# EAGLE schematic GECBalloonMCUFlightBoard_REV2.0_5-6-19 (EAGLE 7.6.0)
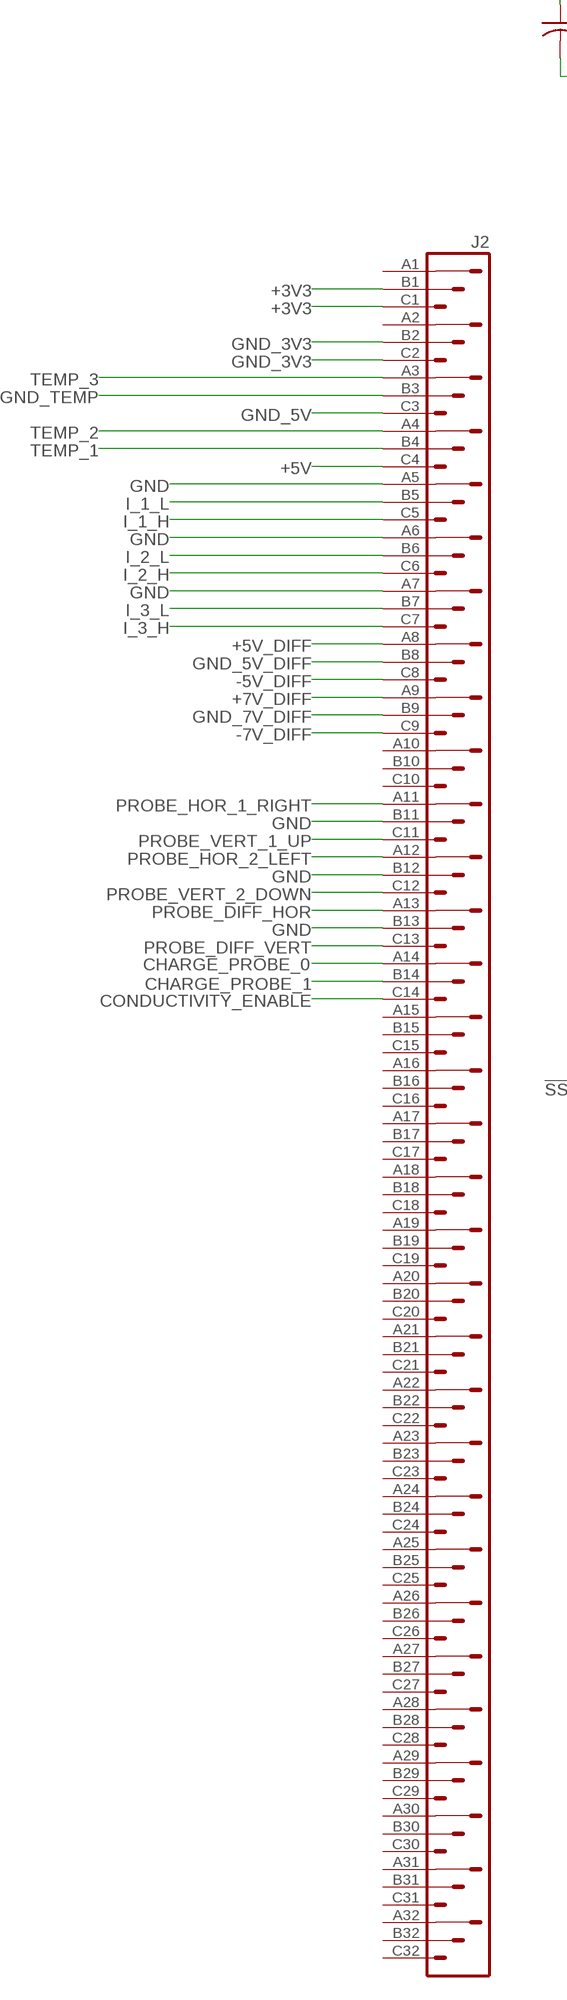
[diagram p0: schematic, sheet 1, part 1 of 2]
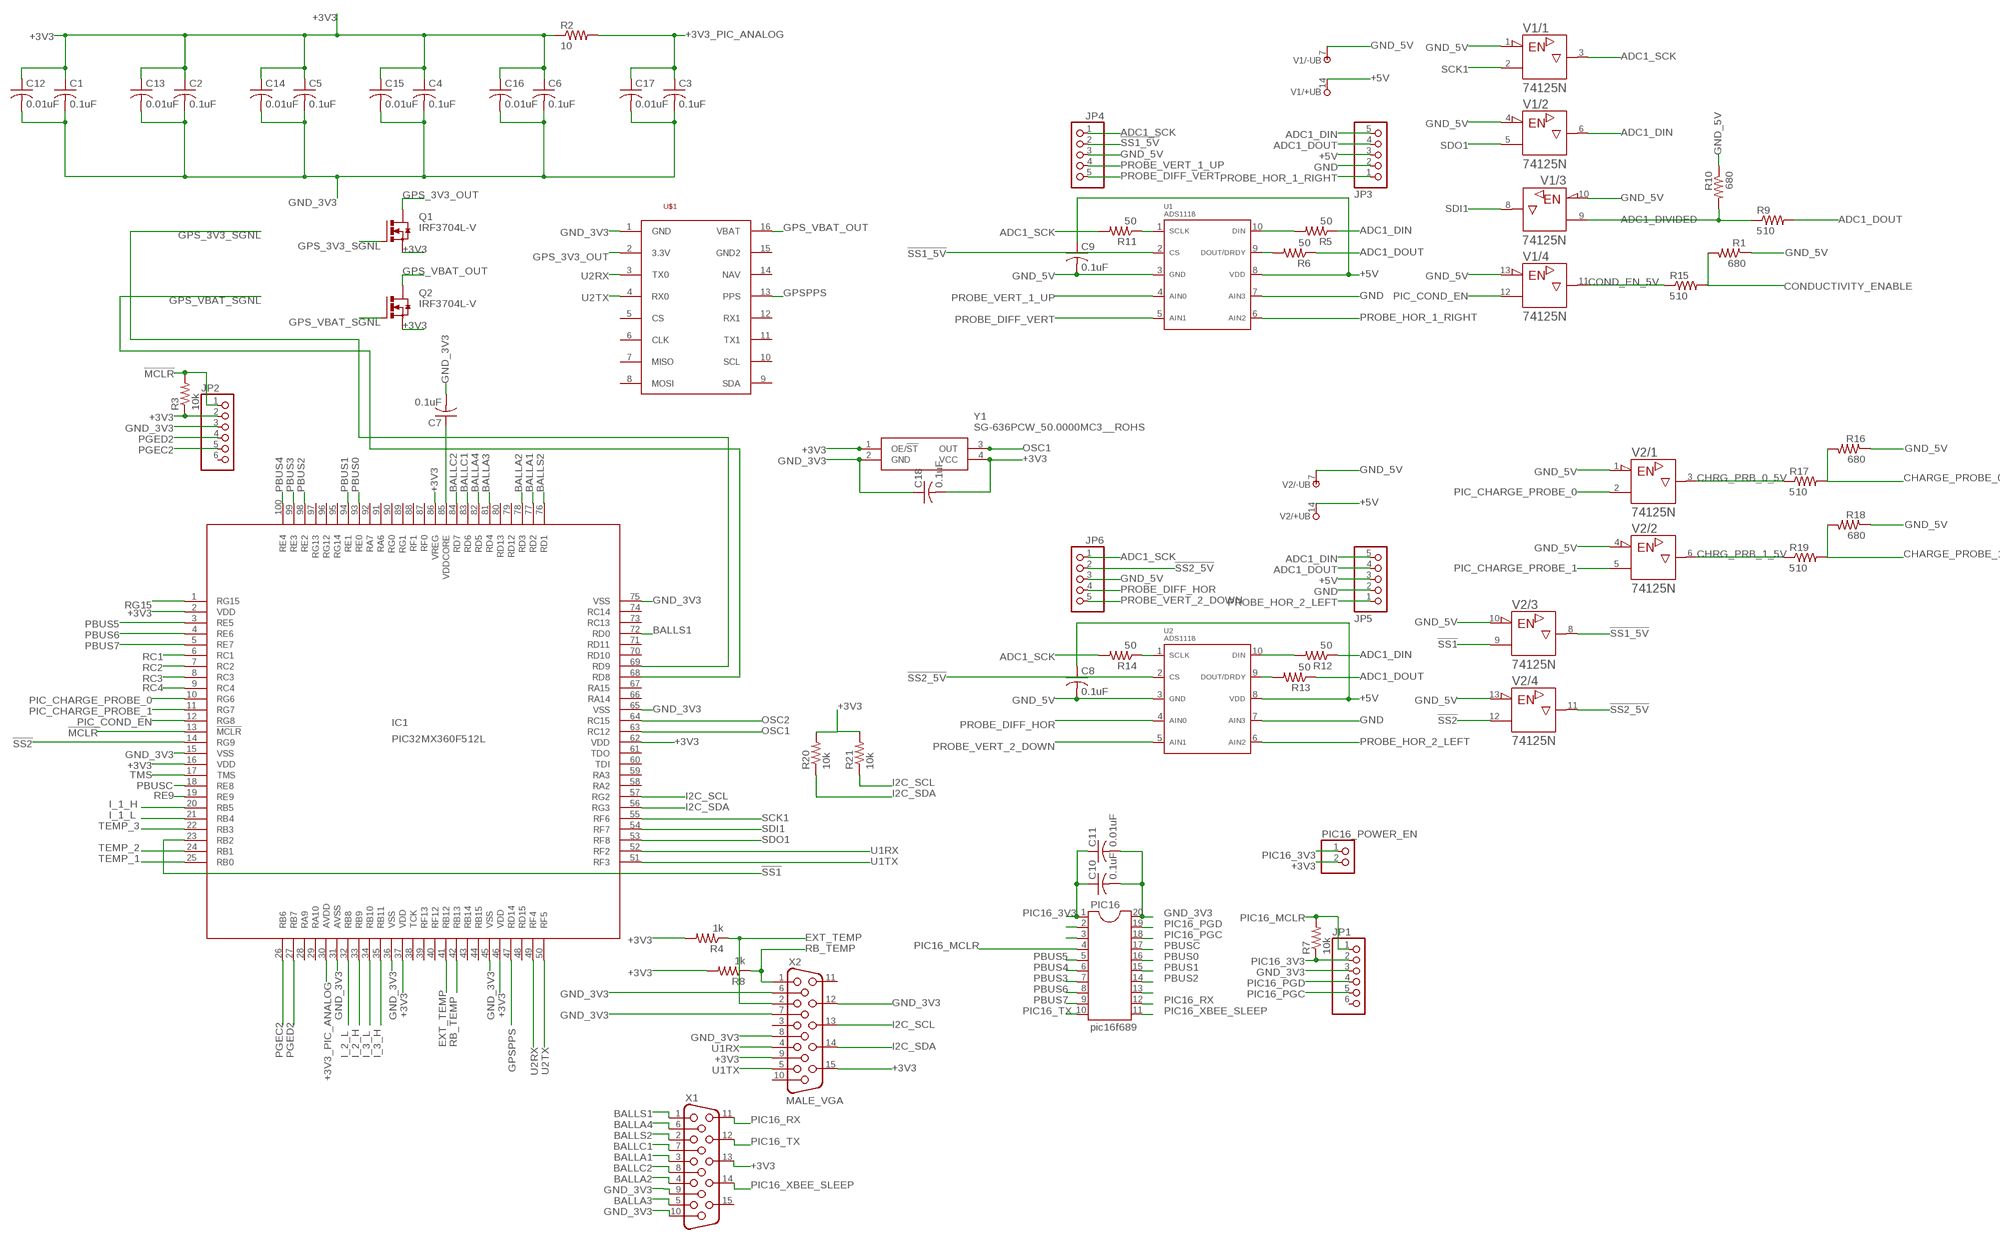
[diagram p1: schematic, sheet 1, part 2 of 2]

## Parts
C1  0.1uF  C-USC1206  [C1206]
C2  0.1uF  C-USC1206  [C1206]
C3  0.1uF  C-USC1206  [C1206]
C4  0.1uF  C-USC1206  [C1206]
C5  0.1uF  C-USC1206  [C1206]
C6  0.1uF  C-USC1206  [C1206]
C7  0.1uF  C-USC1206  [C1206]
C8  0.1uF  C-USC1206  [C1206]
C9  0.1uF  C-USC1206  [C1206]
C10  0.1uF  C-USC1206  [C1206]
C11  0.01uF  C-USC1206  [C1206]
C12  0.01uF  C-USC1206  [C1206]
C13  0.01uF  C-USC1206  [C1206]
C14  0.01uF  C-USC1206  [C1206]
C15  0.01uF  C-USC1206  [C1206]
C16  0.01uF  C-USC1206  [C1206]
C17  0.01uF  C-USC1206  [C1206]
C18  0.1uF  C-USC1206  [C1206]
IC1  PIC32MX360F512L  [TQFP100]
J2  VG96KB  [VG96KB]
JP1  PINHD-1X6  [1X06]
JP2  PINHD-1X6  [1X06]
JP3  PINHD-1X5  [1X05]
JP4  PINHD-1X5  [1X05]
JP5  PINHD-1X5  [1X05]
JP6  PINHD-1X5  [1X05]
PIC16  pic16f689  DIL20  [DIL20]
PIC16_POWER_EN  PINHD-1X2  [1X02]
Q1  IRF3704L-V  [TO262-V]
Q2  IRF3704L-V  [TO262-V]
R1  680  R-US_R1206  [R1206]
R2  10  R-US_M1206  [M1206]
R3  10k  R-US_M1206  [M1206]
R4  1k  R-US_0414/15  [0414/15]
R5  50  R-US_M1206  [M1206]
R6  50  R-US_M1206  [M1206]
R7  10k  R-US_M1206  [M1206]
R8  1k  R-US_0414/15  [0414/15]
R9  510  R-US_R1206  [R1206]
R10  680  R-US_R1206  [R1206]
R11  50  R-US_M1206  [M1206]
R12  50  R-US_M1206  [M1206]
R13  50  R-US_M1206  [M1206]
R14  50  R-US_M1206  [M1206]
R15  510  R-US_R1206  [R1206]
R16  680  R-US_R1206  [R1206]
R17  510  R-US_R1206  [R1206]
R18  680  R-US_R1206  [R1206]
R19  510  R-US_R1206  [R1206]
R20  10k  R-US_M1206  [M1206]
R21  10k  R-US_M1206  [M1206]
U1  ADS1118  ADS1118_MSOP10  [MSOP10]
U2  ADS1118  ADS1118_MSOP10  [MSOP10]
U$1  SPARKFUN_VENUS_GPS_BREAKOUT  [SPARKFUN_BOARD]
V1  74125N  [DIL14]
V2  74125N  [DIL14]
X1  HF15H  [HDF15H]
X2  MALE_VGA  [MALE_PACKAGE]
Y1  SG-636PCW_50.0000MC3__ROHS  [SG-636]

## Nets
!MCLR: IC1.13(!MCLR) JP2.1 R3.2
!SS1: IC1.23(RB2) V2.9(/3:A)
!SS1_5V: JP4.2 U1.2(CS) V2.8(/3:Y)
!SS2: IC1.14(RG9) V2.12(/4:A)
!SS2_5V: JP6.2 U2.2(CS) V2.11(/4:Y)
+3V3 [power]: C1.1 C2.1 C4.1 C5.1 C6.1 C12.1 C13.1 C14.1 C15.1 C16.1 C18.2 IC1.2(VDD) IC1.16(VDD) IC1.37(VDD) IC1.46(VDD) IC1.62(VDD) IC1.86(VREG) J2.B1 J2.C1 JP2.2 PIC16_POWER_EN.2 Q1.3(S) Q2.3(S) R2.1 R3.1 R4.2 R8.2 R20.2 R21.2 X1.13 X2.9 X2.15 Y1.1(OE/!ST) Y1.4(VCC)
+3V3_PIC_ANALOG: C3.1 C17.1 IC1.30(AVDD) R2.2
+5V [power]: C8.1 C9.1 J2.C4 JP3.3 JP5.3 U1.8(VDD) U2.8(VDD) V1.14(/+UB:+UB) V2.14(/+UB:+UB)
+5V_DIFF: J2.A8
+7V_DIFF: J2.A9
-5V_DIFF: J2.C8
-7V_DIFF: J2.C9
ADC1_DIN: JP3.5 JP5.5 R5.1 R12.1 V1.6(/2:Y)
ADC1_DIVIDED: R9.1 R10.2 V1.9(/3:A)
ADC1_DOUT: JP3.4 JP5.4 R6.1 R9.2 R13.1
ADC1_SCK: JP4.1 JP6.1 R11.2 R14.2 V1.3(/1:Y)
BALLA1: IC1.77(RD2) X1.3
BALLA2: IC1.78(RD3) X1.4
BALLA3: IC1.81(RD4) X1.5
BALLA4: IC1.82(RD5) X1.6
BALLC1: IC1.83(RD6) X1.7
BALLC2: IC1.84(RD7) X1.8
BALLS1: IC1.72(RD0) X1.1
BALLS2: IC1.76(RD1) X1.2
CHARGE_PROBE_0: J2.A14 R16.2 R17.2
CHARGE_PROBE_1: J2.B14 R18.2 R19.2
CHRG_PRB_0_5V: R17.1 V2.3(/1:Y)
CHRG_PRB_1_5V: R19.1 V2.6(/2:Y)
COND_EN_5V: R15.1 V1.11(/4:Y)
CONDUCTIVITY_ENABLE: J2.C14 R1.2 R15.2
EXT_TEMP: IC1.41(RB12) R4.1 X2.2
GND [power]: J2.A5 J2.A6 J2.A7 J2.B11 J2.B12 J2.B13 JP3.2 JP5.2 U1.7(AIN3) U2.7(AIN3)
GND_3V3 [power]: C1.2 C2.2 C3.2 C4.2 C5.2 C6.2 C7.2 C10.2 C11.2 C12.2 C13.2 C14.2 C15.2 C16.2 C17.2 C18.1 IC1.15(VSS) IC1.31(AVSS) IC1.36(VSS) IC1.45(VSS) IC1.65(VSS) IC1.75(VSS) J2.B2 J2.C2 JP1.3 JP2.3 PIC16.20 U$1.1(GND) X1.9 X1.10 X2.6 X2.7 X2.8 X2.12 Y1.2(GND)
GND_5V [power]: C8.2 C9.2 J2.C3 JP4.3 JP6.3 R1.1 R10.1 R16.1 R18.1 U1.3(GND) U2.3(GND) V1.1(/1:!G) V1.4(/2:!G) V1.7(/-UB:-UB) V1.10(/3:!G) V1.13(/4:!G) V2.1(/1:!G) V2.4(/2:!G) V2.7(/-UB:-UB) V2.10(/3:!G) V2.13(/4:!G)
GND_5V_DIFF: J2.B8
GND_7V_DIFF: J2.B9
GND_TEMP: J2.B3
GPS_3V3_OUT: Q1.2(D) U$1.2(3.3V)
GPS_3V3_SGNL: IC1.69(RD9) Q1.1(G)
GPS_VBAT_OUT: Q2.2(D) U$1.16(VBAT)
GPS_VBAT_SGNL: IC1.68(RD8) Q2.1(G)
GPSPPS: IC1.47(RD14) U$1.13(PPS)
I2C_SCL: IC1.57(RG2) R21.1 X2.13
I2C_SDA: IC1.56(RG3) R20.1 X2.14
I_1_H: IC1.20(RB5) J2.C5
I_1_L: IC1.21(RB4) J2.B5
I_2_H: IC1.33(RB9) J2.C6
I_2_L: IC1.32(RB8) J2.B6
I_3_H: IC1.35(RB11) J2.C7
I_3_L: IC1.34(RB10) J2.B7
N$1: R5.2 U1.10(DIN)
N$2: PIC16.2
N$3: PIC16.3
N$4: R6.2 U1.9(DOUT/DRDY)
N$6: R11.1 U1.1(SCLK)
N$7: R12.2 U2.10(DIN)
N$8: R13.2 U2.9(DOUT/DRDY)
N$9: R14.1 U2.1(SCLK)
N$18: PIC16.13
OSC1: IC1.63(RC12) Y1.3(OUT)
OSC2: IC1.64(RC15)
PBUS0: IC1.93(RE0) PIC16.16
PBUS1: IC1.94(RE1) PIC16.15
PBUS2: IC1.98(RE2) PIC16.14
PBUS3: IC1.99(RE3) PIC16.7
PBUS4: IC1.100(RE4) PIC16.6
PBUS5: IC1.3(RE5) PIC16.5
PBUS6: IC1.4(RE6) PIC16.8
PBUS7: IC1.5(RE7) PIC16.9
PBUSC: IC1.18(RE8) PIC16.17
PGEC2: IC1.26(RB6) JP2.5
PGED2: IC1.27(RB7) JP2.4
PIC16_3V3 [power]: C10.1 C11.1 JP1.2 PIC16.1 PIC16_POWER_EN.1 R7.1
PIC16_MCLR: JP1.1 PIC16.4 R7.2
PIC16_PGC: JP1.5 PIC16.18
PIC16_PGD: JP1.4 PIC16.19
PIC16_RX: PIC16.12 X1.11
PIC16_TX: PIC16.10 X1.12
PIC16_XBEE_SLEEP: PIC16.11 X1.14
PIC_CHARGE_PROBE_0: IC1.10(RG6) V2.2(/1:A)
PIC_CHARGE_PROBE_1: IC1.11(RG7) V2.5(/2:A)
PIC_COND_EN: IC1.12(RG8) V1.12(/4:A)
PROBE_DIFF_HOR: J2.A13 JP6.4 U2.4(AIN0)
PROBE_DIFF_VERT: J2.C13 JP4.5 U1.5(AIN1)
PROBE_HOR_1_RIGHT: J2.A11 JP3.1 U1.6(AIN2)
PROBE_HOR_2_LEFT: J2.A12 JP5.1 U2.6(AIN2)
PROBE_VERT_1_UP: J2.C11 JP4.4 U1.4(AIN0)
PROBE_VERT_2_DOWN: J2.C12 JP6.5 U2.5(AIN1)
RB_TEMP: IC1.42(RB13) R8.1 X2.1
RC1: IC1.6(RC1)
RC2: IC1.7(RC2)
RC3: IC1.8(RC3)
RC4: IC1.9(RC4)
RE9: IC1.19(RE9)
RG15: IC1.1(RG15)
SCK1: IC1.55(RF6) V1.2(/1:A)
SDI1: IC1.54(RF7) V1.8(/3:Y)
SDO1: IC1.53(RF8) V1.5(/2:A)
TEMP_1: IC1.25(RB0) J2.B4
TEMP_2: IC1.24(RB1) J2.A4
TEMP_3: IC1.22(RB3) J2.A3
TMS: IC1.17(TMS)
U1RX: IC1.52(RF2) X2.4
U1TX: IC1.51(RF3) X2.5
U2RX: IC1.49(RF4) U$1.3(TX0)
U2TX: IC1.50(RF5) U$1.4(RX0)
VCAP/VCORE: C7.1 IC1.85(VDDCORE)
Unconnected: IC1.28(RA9) IC1.29(RA10) IC1.38(TCK) IC1.39(RF13) IC1.40(RF12) IC1.43(RB14) IC1.44(RB15) IC1.48(RD15) IC1.58(RA2) IC1.59(RA3) IC1.60(TDI) IC1.61(TDO) IC1.66(RA14) IC1.67(RA15) IC1.70(RD10) IC1.71(RD11) IC1.73(RC13) IC1.74(RC14) IC1.79(RD12) IC1.80(RD13) IC1.87(RF0) IC1.88(RF1) IC1.89(RG1) IC1.90(RG0) IC1.91(RA6) IC1.92(RA7) IC1.95(RG14) IC1.96(RG12) IC1.97(RG13) J2.A1 J2.A2 J2.A10 J2.A15 J2.A16 J2.A17 J2.A18 J2.A19 J2.A20 J2.A21 J2.A22 J2.A23 J2.A24 J2.A25 J2.A26 J2.A27 J2.A28 J2.A29 J2.A30 J2.A31 J2.A32 J2.B10 J2.B15 J2.B16 J2.B17 J2.B18 J2.B19 J2.B20 J2.B21 J2.B22 J2.B23 J2.B24 J2.B25 J2.B26 J2.B27 J2.B28 J2.B29 J2.B30 J2.B31 J2.B32 J2.C10 J2.C15 J2.C16 J2.C17 J2.C18 J2.C19 J2.C20 J2.C21 J2.C22 J2.C23 J2.C24 J2.C25 J2.C26 J2.C27 J2.C28 J2.C29 J2.C30 J2.C31 J2.C32 JP1.6 JP2.6 U$1.5(CS) U$1.6(CLK) U$1.7(MISO) U$1.8(MOSI) U$1.9(SDA) U$1.10(SCL) U$1.11(TX1) U$1.12(RX1) U$1.14(NAV) U$1.15(GND2) X1.15 X2.3 X2.10 X2.11

## Library data of the parts
C1-C18 = resistor:C-US: CAPACITOR, American symbol
IC1 = PIC_BoardLibrarymicrochip:PIC32MX360F512L: PIC32MX360F512L edit this description Auto generated by make-symbol-device-package-bsdl.ulp Rev. 25 Source: PIC32MX360F512L.bsdl
J2 = 19inch_VG96KB:VG96: PCB EUROCARD, 96-pin type C/ABC, 2.54 mm
JP1 JP2 = pinhead:PINHD-1X6: PIN HEADER
JP3-JP6 = pinhead:PINHD-1X5: PIN HEADER
PIC16 = ic-package:DIL20: Dual In Line / Socket
PIC16_POWER_EN = pinhead:PINHD-1X2: PIN HEADER
Q1 Q2 = transistor-power:IRF3704: SMPS MOSFET HEXFET® Power MOSFET Source: http://www.irf.com/product-info/datasheets/data/irf3704.pdf
R1 R4 R8-R10 R15-R19 = resistor:R-US_: RESISTOR, American symbol
R2 R3 R5-R7 R11-R14 R20 R21 = rcl:R-US_: RESISTOR, American symbol
U1 U2 = ADS1118:ADS1118_MSOP10: Ultra-Small QFN Package: 2mm × 1,5 mm × 0,4 mm Wide Supply Range: 2.0 V to 5.5 V Low Current Consumption: Continuous Mode: Only 150 µA Single-Shot Mode: Auto Power-Down Programmable Data Rate: 8 SPS to 860 SPS Single-Cycle Settling Internal Low-Drift Voltage Reference Internal Temperature Sensor: 0.5°C (max) Error Internal Oscillator Internal PGA Four Single-Ended or Two Differential Inputs
U$1 = SparkfunVenusGPSBreakout:SPARKFUN_VENUS_GPS_BREAKOUT: Sparkfun Venus GPS Breakout Board
V1 V2 = 74ttl-din:74*125: Quad bus BUFFER, 3-state
X1 = con-subd:HF15: SUB-D; OC_FARNELL: unknown; OC_NEWARK: unknown
X2 = MALE_VGA:MALE_VGA
Y1 = SG-636PCW_50.0000MC3__ROHS:SG-636PCW_50.0000MC3__ROHS: Standard Clock Oscillators 50MHz 3.3Volt 100ppm -20C +70C Source: Datasheet <http://www.mouser.com/ds/2/137/G-636PCE_en-1003252.pdf>; ARROW_PART_NUMBER: SG-636PCW 50.0000MC3: ROHS; DESCRIPTION: Standard Clock Oscillators 50MHz 3.3Volt 100ppm -20C +70C; HEIGHT: mm; MANUFACTURER_NAME: Epson Timing; MANUFACTURER_PART_NUMBER: SG-636PCW 50.0000MC3: ROHS

## Net classes
0 default: width 0.203 mm, drill 0.33 mm, clearance 0.152 mm
1 power: width 0.406 mm, drill 0.33 mm, clearance 0.152 mm